# Altium project COUNTER.PrjPcb
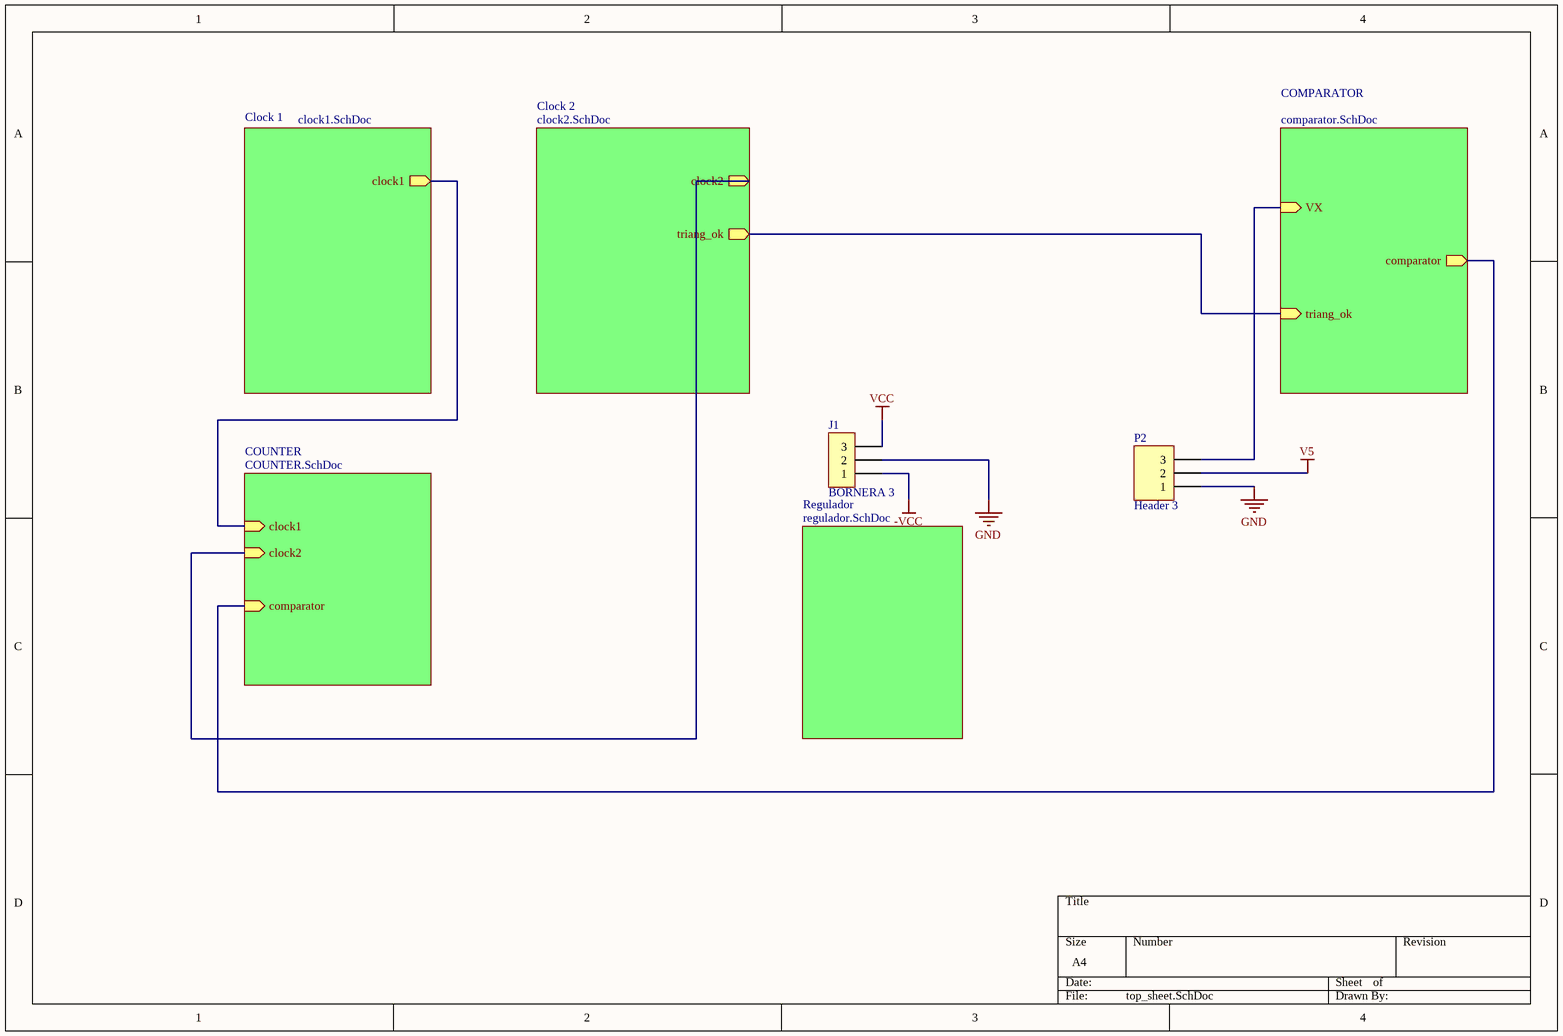
[diagram p0: top_sheet.SchDoc]
6 sheets, 37 parts. Net scope: hierarchical (ports join the sheet entries above them; power ports are global).
Sheets:
  top_sheet.SchDoc
    Clock 1 = clock1.SchDoc
    Clock 2 = clock2.SchDoc
    COUNTER = COUNTER.SchDoc
    COMPARATOR = comparator.SchDoc
    Regulador = regulador.SchDoc

## Sheet top_sheet.SchDoc
size A4

### Parts
J1  BORNERA 3  [BORNERA3]
P2  Header 3  [HDR1X3]

### Sub-sheets
Clock 1 = clock1.SchDoc: clock1 (out)
Clock 2 = clock2.SchDoc: clock2 (out), triang_ok (out)
COMPARATOR = comparator.SchDoc: VX (in), triang_ok (in), comparator (out)
COUNTER = COUNTER.SchDoc: clock1 (in), clock2 (in), comparator (in)
Regulador = regulador.SchDoc: no entries

### Nets
-VCC: J1.1
GND: J1.2 P2.1
V5: P2.2
VCC: J1.3  [project net Va]
comp: sheet COUNTER/comparator, sheet COMPARATOR/comparator
NetP2_3: P2.3 ; sheet COMPARATOR/VX
NetR3_2: sheet Clock 2/triang_ok, sheet COMPARATOR/triang_ok
NetR4_1: sheet Clock 2/clock2, sheet COUNTER/clock2
NetTP1_1: sheet Clock 1/clock1, sheet COUNTER/clock1

### Library data of the parts
P2 = Header 3: Header, 3-Pin; LatestRevisionDate: 17-Jul-2002; LatestRevisionNote: Re-released for DXP Platform.; Publisher: Altium Limited

## Sheet clock1.SchDoc
size A4
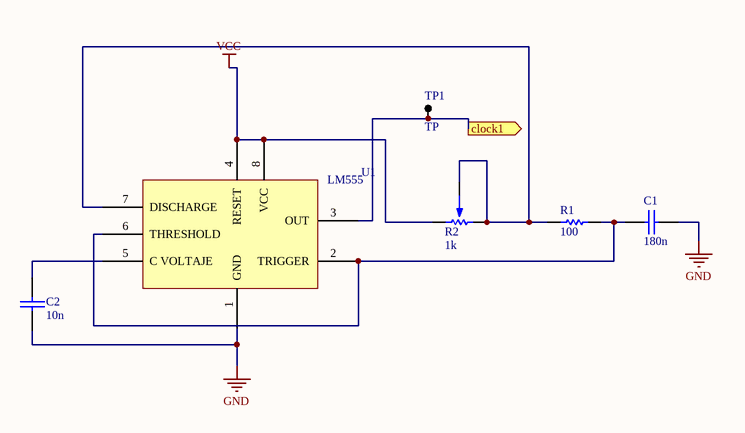
[diagram p1: clock1.SchDoc]

### Parts
C1  180n  [0805]
C2  10n  [CAP200]
R1  100  [0805]
R2  1k  [PRESET H]
TP1  TP  [TPTH]
U1  LM555  [DIP8]

### Ports
clock1 (out)

### Nets
GND: C1.2 C2.1 U1.1(GND)
VCC: R2.1 U1.4(RESET) U1.8(VCC)  [project net Va]
NetC1_1: C1.1 R1.2 U1.2(TRIGGER) U1.6(THRESHOLD)
NetC2_2: C2.2 U1.5(C_VOLTAJE)
NetR1_1: R1.1 R2.2 R2.3 U1.7(DISCHARGE)
NetTP1_1: TP1.1 U1.3(OUT) ; port clock1

### Library data of the parts
C1 C2 = CAP
R1 = RES
R2 = PRESET
U1 = LM555: Timer

## Sheet clock2.SchDoc
size A4
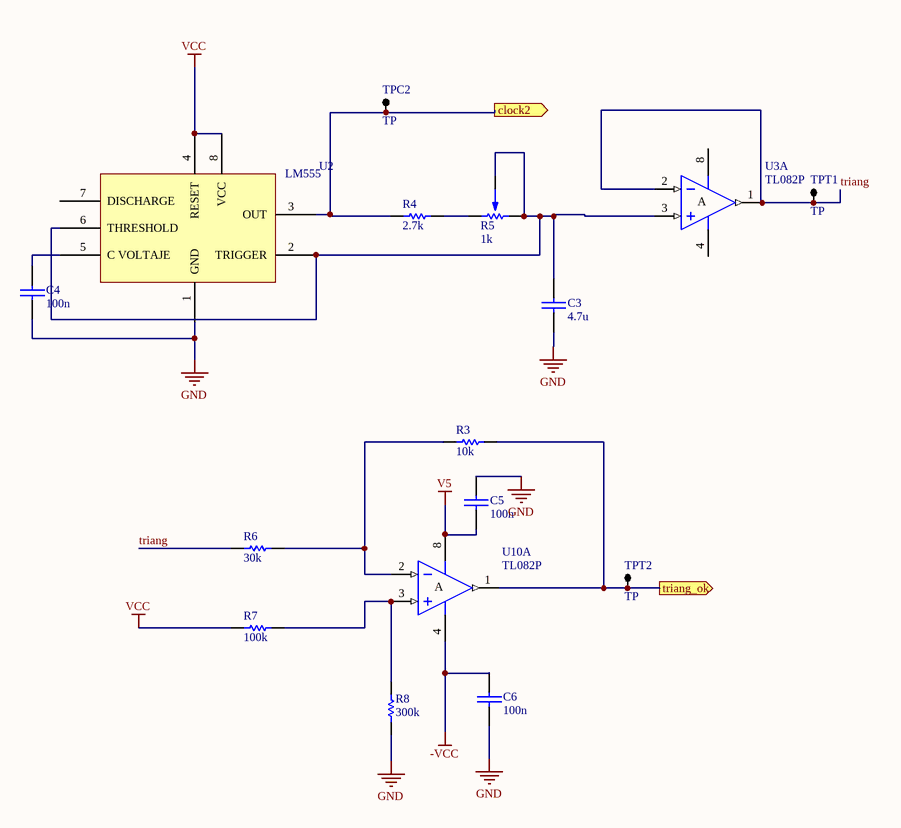
[diagram p2: clock2.SchDoc]

### Parts
C3  4.7u  [0805]
C4  100n  [CAP200]
C5  100n  [0805]
C6  100n  [0805]
R3  10k  [0805]
R4  2.7k  [RES400]
R5  1k  [PRESET H]
R6  30k  [0805]
R7  100k  [0805]
R8  300k  [0805]
TPC2  TP  [TPTH]
TPT1  TP  [TPTH]
TPT2  TP  [TPTH]
U2  LM555  [DIP8]
U3  TL082P  [P008]  (part A of 2)
U10  TL082P  [P008]  (part A of 2)

### Ports
clock2 (out), triang_ok (out)

### Nets
-VCC: C6.1 U10.4(V-)
GND: C3.2 C4.1 C5.1 C6.2 R8.1 U2.1(GND)
V5: C5.2 U10.8(V+)
VCC: R7.1 U2.4(RESET) U2.8(VCC)  [project net Va]
triang: R6.1 TPT1.1 U3.1(OUT) U3.2(IN-)
NetC3_1: C3.1 R5.2 R5.3 U2.2(TRIGGER) U2.6(THRESHOLD) U3.3(IN+)
NetC4_2: C4.2 U2.5(C_VOLTAJE)
NetR3_1: R3.1 R6.2 U10.2(IN-)
NetR3_2: R3.2 TPT2.1 U10.1(OUT) ; port triang_ok
NetR4_1: R4.1 TPC2.1 U2.3(OUT) ; port clock2
NetR4_2: R4.2 R5.1
NetR7_2: R7.2 R8.2 U10.3(IN+)

Not connected (* = marked no-connect by the designer): U2 7(DISCHARGE); U3 4(V-) 8(V+)

### Notes on the sheet
- (in symbol TL082P, part A) A

### Library data of the parts
C3-C6 = CAP
R3 R4 R6-R8 = RES
R5 = PRESET
U2 = LM555: Timer
U3 U10 = TL082P: JFET-Input Operational Amplifier; Published: 16-Jan-2001; LatestRevisionDate: 04-Mar-2005; LatestRevisionNote: Stylized 3D Model Added.; DatasheetVersion: Feb-1999; PackageVersion: Jun-1999; PackageReference: P008; Publisher: Altium Limited; PackageDescription: DIP; 8 Leads; Row Spacing 7.62 mm; Pitch 2.54 mm; Code_JEDEC: MO-001-AN; ComponentLink1Description: Manufacturer Link; ComponentLink1URL: http://www.ti.com/; ComponentLink2Description: Datasheet; ComponentLink2URL: http://www-s.ti.com/sc/ds/tl082.pdf

## Sheet COUNTER.SchDoc
size A4
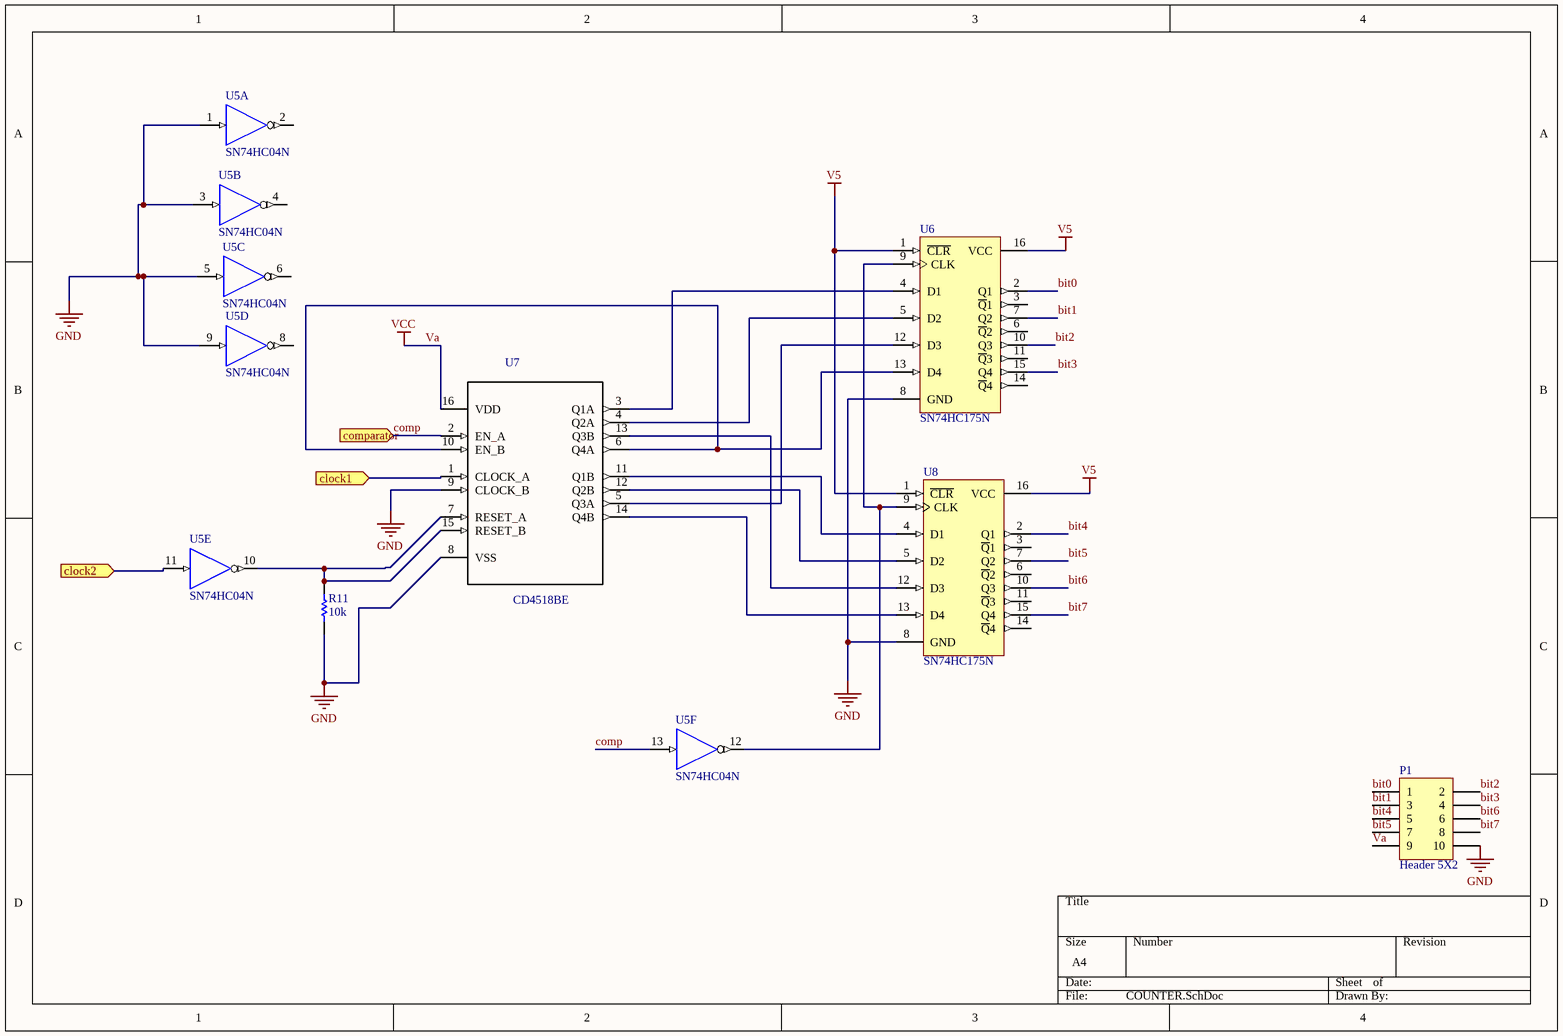
[diagram p3: COUNTER.SchDoc]

### Parts
P1  Header 5X2  [HDR2X5]
R11  10k  [RES400]
U5  SN74HC04N  [N014]  (parts A,B,C,D,E,F of 6)
U6  SN74HC175N  [N016]
U7  CD4518BE  [*DIP254P762X508-16]
U8  SN74HC175N  [N016]

### Ports
clock1 (in), clock2 (in), comparator (in)

### Nets
GND: P1.10 R11.1 U5.1(A) U5.3(A) U5.5(A) U5.7(GND) U5.9(A) U6.8(GND) U7.8(VSS) U7.9(CLOCK_B) U8.8(GND)
V5: U5.14(V5) U6.1(~{CLR}) U6.16(VCC) U8.1(~{CLR}) U8.16(VCC)
Va: P1.9 U7.16(VDD)  [also labelled VCC]
bit0: P1.1 U6.2(Q1)
bit1: P1.3 U6.7(Q2)
bit2: P1.2 U6.10(Q3)
bit3: P1.4 U6.15(Q4)
bit4: P1.5 U8.2(Q1)
bit5: P1.7 U8.7(Q2)
bit6: P1.6 U8.10(Q3)
bit7: P1.8 U8.15(Q4)
comp: U5.13(A) U7.2(EN_A) ; port comparator
NetR4_1: U5.11(A) ; port clock2
NetR11_2: R11.2 U5.10(Y) U7.7(RESET_A) U7.15(RESET_B)
NetTP1_1: U7.1(CLOCK_A) ; port clock1
NetU5_12: U5.12(Y) U6.9(CLK) U8.9(CLK)
NetU6_4: U6.4(D1) U7.3(Q1A)
NetU6_5: U6.5(D2) U7.4(Q2A)
NetU6_12: U6.12(D3) U7.5(Q3A)
NetU6_13: U6.13(D4) U7.6(Q4A) U7.10(EN_B)
NetU7_11: U7.11(Q1B) U8.4(D1)
NetU7_12: U7.12(Q2B) U8.5(D2)
NetU7_13: U7.13(Q3B) U8.12(D3)
NetU7_14: U7.14(Q4B) U8.13(D4)

Not connected (* = marked no-connect by the designer): U5 2(Y) 4(Y) 6(Y) 8(Y); U6 3(~{Q}1) 6(~{Q}2) 11(~{Q}3) 14(~{Q}4); U8 3(~{Q}1) 6(~{Q}2) 11(~{Q}3) 14(~{Q}4)

### Library data of the parts
P1 = Header 5X2: Header, 5-Pin, Dual row; LatestRevisionDate: 17-Jul-2002; LatestRevisionNote: Re-released for DXP Platform.; Publisher: Altium Limited
R11 = RES
U5 = SN74HC04N: Hex Inverter; Published: 8-Jun-2000; LatestRevisionDate: 04-Mar-2005; LatestRevisionNote: Stylized 3D Model Added.; DatasheetVersion: May-1997; PackageVersion: Oct-1995; PackageReference: N014; Publisher: Altium Limited; PackageDescription: DIP; 14 Leads; Row Spacing 7.62 mm; Pitch 2.54 mm; ComponentLink1Description: Manufacturer Link; ComponentLink1URL: http://www.ti.com/; ComponentLink2Description: Datasheet; ComponentLink2URL: http://www-s.ti.com/sc/ds/sn74hc04.pdf
U6 U8 = SN74HC175N: Quadruple D-Type Flip-Flop with Clear; Published: 8-Jun-2000; LatestRevisionDate: 04-Mar-2005; LatestRevisionNote: Stylized 3D Model Added.; DatasheetVersion: May-1997; PackageVersion: Oct-1995; PackageReference: N016; Publisher: Altium Limited; PackageDescription: DIP; 16 Leads; Row Spacing 7.62 mm; Pitch 2.54 mm; Code_JEDEC: MS-001-BB; ComponentLink1Description: Manufacturer Link; ComponentLink1URL: http://www.ti.com/; ComponentLink2Description: Datasheet; ComponentLink2URL: http://www-s.ti.com/sc/ds/sn74hc175.pdf
U7 = CD4518BE: MF: Texas Instruments; MP: CD4518BE; Package: DIP-16 RCA; Digi-Key_Purchase_URL: https://www.digikey.com.ar/product-detail/en/texas-instruments/CD4518BE/296-2076-5-ND/67351?utm_source=snapeda&utm_medium=aggregator&utm_campaign=symbol; Digi-Key_Part_Number: 296-2076-5-ND; SnapEDA_Link: https://www.snapeda.com/parts/CD4518BE/Texas%20Instruments/view-part/?ref=snap; Value: *

## Sheet comparator.SchDoc
size A4
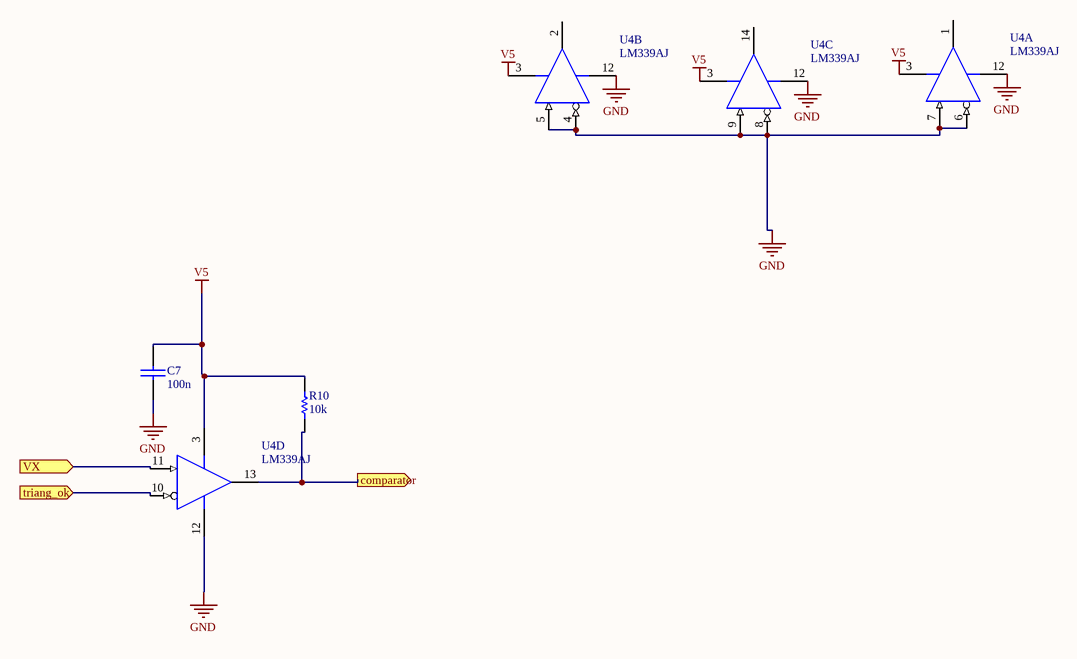
[diagram p4: comparator.SchDoc]

### Parts
C7  100n  [CAP200]
R10  10k  [RES400]
U4  LM339AJ  [J014]  (parts A,B,C,D of 4)

### Ports
comparator (out), triang_ok (in), VX (in)

### Nets
GND: C7.2 U4.4(IN-) U4.5(IN+) U4.6(IN-) U4.7(IN+) U4.8(IN-) U4.9(IN+) U4.12(GND)
V5: C7.1 R10.2 U4.3(VCC)
comp: R10.1 U4.13(OUT) ; port comparator
NetP2_3: U4.11(IN+) ; port VX
NetR3_2: U4.10(IN-) ; port triang_ok

Not connected (* = marked no-connect by the designer): U4 1(OUT) 2(OUT) 14(OUT)

### Library data of the parts
C7 = CAP
R10 = RES
U4 = LM339AJ: Quad Differential Comparator; Published: 15-Apr-2002; LatestRevisionDate: 04-Mar-2005; LatestRevisionNote: Stylized 3D Model Added.; DatasheetVersion: Apr-1988; PackageVersion: Jun-1999; PackageReference: J014; Publisher: Altium Limited; PackageDescription: DIP; 14 Leads; Row Spacing 7.62 mm; Pitch 2.54 mm; ComponentLink1Description: Manufacturer Link; ComponentLink1URL: http://www.ti.com/; ComponentLink2Description: Datasheet; ComponentLink2URL: http://www-s.ti.com/sc/ds/lm139a.pdf

## Sheet regulador.SchDoc
size A4
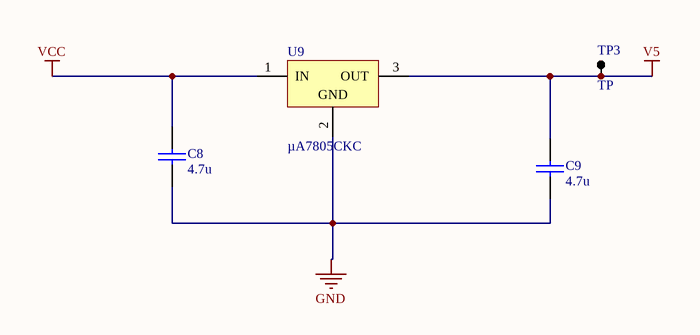
[diagram p5: regulador.SchDoc]

### Parts
C8  4.7u  [0805]
C9  4.7u  [0805]
TP3  TP  [TPTH]
U9  µA7805CKC  [KC03]

### Nets
GND: C8.2 C9.2 U9.2(GND)
V5: C9.1 TP3.1 U9.3(OUT)
VCC: C8.1 U9.1(IN)  [project net Va]

### Library data of the parts
C8 C9 = CAP
U9 = µA7805CKC: Positive-Voltage Regulator; Note: Pin 2 is electrically connected to TAB.; Published: 15-Apr-2002; DatasheetVersion: Jul-1999; PackageVersion: Sep-1995; PackageReference: KC03; Publisher: Altium Limited; PackageDescription: TO, Thru-Hole, Vertical, Heatsink Mounted; 3 In-Line Leads; Pitch 2.54 mm; ComponentLink1Description: Manufacturer Link; ComponentLink1URL: http://www.ti.com/; ComponentLink2Description: Datasheet; ComponentLink2URL: http://www-s.ti.com/sc/ds/ua7805.pdf

## Nets that join several sheets
-VCC: top_sheet (J1.1), clock2 (C6.1 U10.4)
GND: top_sheet (J1.2 P2.1), clock1 (C1.2 C2.1 U1.1), clock2 (6 pins), COUNTER (11 pins), comparator (8 pins), regulador (C8.2 C9.2 U9.2)
V5: top_sheet (P2.2), clock2 (C5.2 U10.8), COUNTER (5 pins), comparator (C7.1 R10.2 U4.3), regulador (C9.1 TP3.1 U9.3)
Va: top_sheet (J1.3), clock1 (R2.1 U1.4 U1.8), clock2 (R7.1 U2.4 U2.8), COUNTER (P1.9 U7.16), regulador (C8.1 U9.1)
comp: COUNTER (U5.13 U7.2), comparator (R10.1 U4.13)
NetP2_3: top_sheet (P2.3), comparator (U4.11)
NetR3_2: clock2 (R3.2 TPT2.1 U10.1), comparator (U4.10)
NetR4_1: clock2 (R4.1 TPC2.1 U2.3), COUNTER (U5.11)
NetTP1_1: clock1 (TP1.1 U1.3), COUNTER (U7.1)